# Altium schematic sheet Schematic_Sheet_1.SchDoc
size A4; SheetNumber: 1; SheetTotal: 1
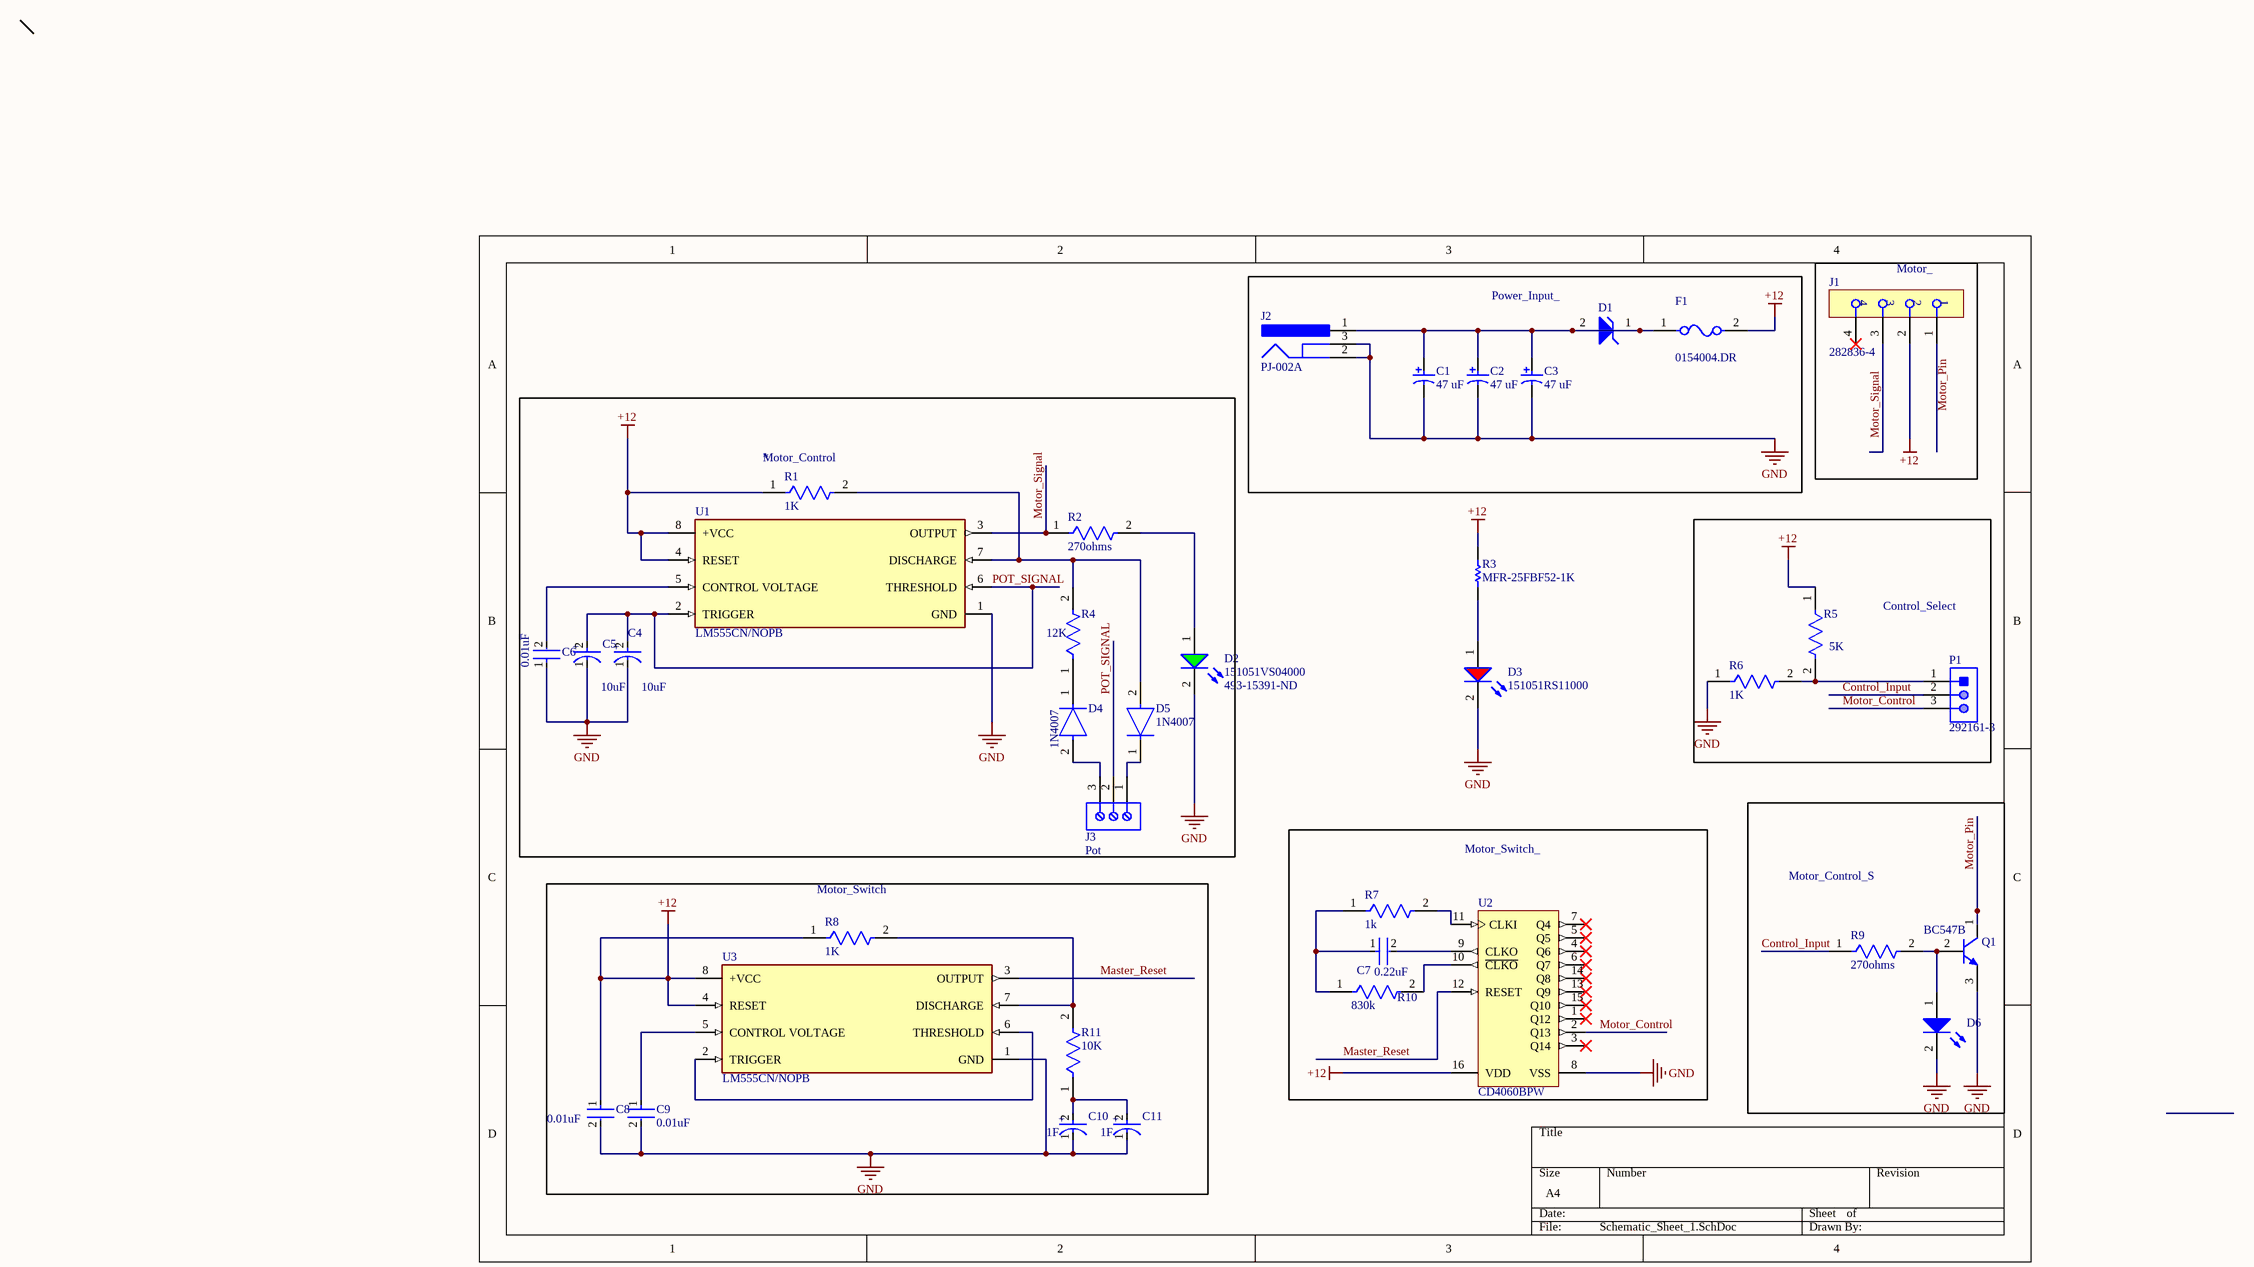
[diagram p0: Schematic_Sheet_1.SchDoc]

## Parts
C1  47 uF  [NIC-UVR-5x11-2_V]
C2  47 uF  [NIC-UVR-5x11-2_V]
C3  47 uF  [NIC-UVR-5x11-2_V]
C4  10uF  [FP-RAD-TH-D_12_5_0_5-L_20-MFG]
C5  10uF  [FP-RAD-TH-D_12_5_0_5-L_20-MFG]
C6  0.01uF  [FP-C410C104M5U5TA7200-MFG]
C7  0.22uF  [FP-C410C104M5U5TA7200-MFG]
C8  0.01uF  [FP-C410C104M5U5TA7200-MFG]
C9  0.01uF  [FP-C410C104M5U5TA7200-MFG]
C10  1F  [FP-RAD-TH-D_12_5_0_5-L_20-MFG]
C11  1F  [FP-RAD-TH-D_12_5_0_5-L_20-MFG]
D1  P6KE36ARLG  [ONSC-SURMETIC40-2-017AA-01]  (value not drawn)
D2  151051VS04000  Supplier Part Number 1: 493-15391-ND  [WL-TMRC_D5.9H8.7]
D3  151051RS11000  [WL-TMRC_D5.9H8.7]
D4  1N4007  [FP-1N4007-MFG]
D5  1N4007  [FP-1N4007-MFG]
D6  151051BS04000  [WL-TMRC_D5.9H8.7]  (value not drawn)
F1  0154004.DR  [FP-0154-MFG]
J1  282836-4  [FP-282836-4-MFG]
J2  PJ-002A  [CUI-PJ-002A_V]
J3  Pot  [691101710003]
P1  292161-3  [TECO-292161-3_V]
Q1  BC547B  [ONSC-TO-92-3-29-11]
R1  1K  [FP-MRS1600-MFG]
R2  270ohms  [FP-MRS1600-MFG]
R3  MFR-25FBF52-1K  [RESA60-630X240]
R4  12K  [FP-MRS1600-MFG]
R5  5K  [FP-MRS1600-MFG]
R6  1K  [FP-MRS1600-MFG]
R7  1k  [FP-MRS1600-MFG]
R8  1K  [FP-MRS1600-MFG]
R9  270ohms  [FP-MRS1600-MFG]
R10  830k  [FP-MRS1600-MFG]
R11  10K  [FP-MRS1600-MFG]
U1  LM555CN/NOPB  [FP-P0008A-MFG]
U2  CD4060BPW  [PW0016A_L]
U3  LM555CN/NOPB  [FP-P0008A-MFG]

## Blocks framed on the sheet
Power_Input_: C1-C3 D1 F1 J2
Motor_: J1
Motor_Control: C4-C6 D2 D4 D5 J3 R1 R2 R4 U1
Control_Select: P1 R5 R6
Motor_Switch_: C7 R7 R10 U2
Motor_Control_S: D6 Q1 R9
Motor_Switch: C8-C11 R8 R11 U3

## Nets
+12: C8.1 F1.2 J1.2 R1.1 R3.1 R5.1 R8.1 U1.4(RESET) U1.8(+VCC) U2.16(VDD) U3.4(RESET) U3.8(+VCC)
GND: C1.2 C2.2 C3.2 C4.1(C) C5.1(C) C6.1 C8.2 C9.2 C10.1(C) C11.1(C) D2.2(K) D3.2(K) D6.2(K) J2.2 J2.3 Q1.3(E) R6.1 U1.1(GND) U2.8(VSS) U3.1(GND)
Control_Input: P1.2 R9.1
Master_Reset: U2.12(RESET) U3.3(OUTPUT)
Motor_Control: P1.3 U2.2(Q13)
Motor_Pin: Q1.1(C)
Motor_Signal: J1.3 R2.1 U1.3(OUTPUT)
POT_SIGNAL: C4.2(A) C5.2(A) J3.2 U1.2(TRIGGER) U1.6(THRESHOLD)
NetC1_1: C1.1 C2.1 C3.1 D1.1(K) D1.2(A) F1.1 J2.1
NetC6_2: C6.2 U1.5(CONTROL_VOLTAGE)
NetC7_1: C7.1 R7.1 R10.1
NetC7_2: C7.2 U2.9(CLKO)
NetC9_1: C9.1 U3.5(CONTROL_VOLTAGE)
NetC10_2: C10.2(A) C11.2(A) R11.1
NetD2_1: D2.1(A) R2.2
NetD3_1: D3.1(A) R3.2
NetD4_1: D4.1(C) R4.1
NetD4_2: D4.2(A) J3.3
NetD5_1: D5.1(C) J3.1
NetD5_2: D5.2(A) R1.2 R4.2 U1.7(DISCHARGE)
NetD6_1: D6.1(A) Q1.2(B) R9.2
NetP1_1: P1.1 R5.2 R6.2
NetR7_2: R7.2 U2.11(CLKI)
NetR8_2: R8.2 R11.2 U3.7(DISCHARGE)
NetR10_2: R10.2 U2.10(~{CLKO})
NetU3_2: U3.2(TRIGGER) U3.6(THRESHOLD)

Not connected (* = marked no-connect by the designer): J1 1 4*; U2 1(Q12)* 3(Q14)* 4(Q6)* 5(Q5)* 6(Q7)* 7(Q4)* 13(Q9)* 14(Q8)* 15(Q10)*

## Notes on the sheet
- Labels drawn without touching a wire or pin: Motor_Pin
- (in symbol CMP-05427-000677-1) +

## Library data of the parts
C1-C3 = CMP-1217-00002-1: Aluminum Electrolytic Capacitor, 47 uF +/-20%, 35 V, -40 to 85 degC, 2-Pin THD, RoHS, Bulk; Manufacturer: Nichicon; PartNumber: UVR1V470MDD; Rated Voltage: 35 V; Rated Ripple: 130 mA; Mounting Technology: Through Hole; Temperature Range: -40 to 85 degC; Rated Capacitance: 47 uF; ComponentLink3Description: Package Specification; ComponentLink1URL: http://www.nichicon.co.jp/; Packing: Bulk; DatasheetVersion: Sep-13; RoHS: TRUE; PackageDescription: 2-Pin Through Hole Device, Dia 5 mm, Body Length 11 mm, Pin Spacing 2 mm; ComponentLink3URL: http://nichicon-us.com/english/products/pdfs/e-vr.pdf; ComponentLink1Description: Manufacturer URL; Capacitance Tolerance: +/-20%; ComponentLink2Description: Datasheet; ComponentLink2URL: http://nichicon-us.com/english/products/pdfs/e-vr.pdf
C4 C5 = CMP-05427-000677-1: Aluminum Electrolytic Capacitors (Radial Lead Type) 20uF ±20% 450V; Ripple Current: 130mA; Lead Diameter: 0.6mm; Life (Hours): 2000Hour; Lead/Base Style: Straight; Package Quantity: 500; Radiation Hardening: No; Series: M; Voltage Rating (DC): 450V; Voltage Rating: 450V; Lead Pitch: 5mm; Height - Seated (Max): 0.866inch; Max Operating Temperature: 85°C; Termination: Radial; Case/Package: Radial; Capacitance: 10uF; Min Operating Temperature: -25°C; Tolerance: 20%; Length: 20mm; Mount: Through Hole; Height: 20mm; Packaging: Ammo Pack; Diameter: 12.5mm; RoHS Compliant: Yes
C6-C9 = CMP-03020-034640-1: CAP CER 0.1UF 50V Z5U AXIAL; Capacitance: 100nF; Tolerance: 20%; Lead Diameter: 0.51mm; Dissipation Factor: 4%; Lead Length: 25.4mm; Mount: Through Hole; Length: 4.32mm; Lead Free: Lead Free; Number of Pins: 2; Case/Package: Axial; Max Operating Temperature: 85°C; RoHS Compliant: Yes; Dielectric: Z5U; Min Operating Temperature: 10°C; Series: Aximax 400; Termination: Axial; Radiation Hardening: No; Voltage Rating (DC): 50V; REACH SVHC: No SVHC; Construction: AXIAL; Package Quantity: 5000; Packaging: Tape and Reel; Voltage Rating: 50V
C10 C11 = CMP-05427-000677-1: Aluminum Electrolytic Capacitors (Radial Lead Type) 10uF ±20% 450V; Ripple Current: 130mA; Lead Diameter: 0.6mm; Life (Hours): 2000Hour; Lead/Base Style: Straight; Package Quantity: 500; Radiation Hardening: No; Series: M; Voltage Rating (DC): 450V; Voltage Rating: 450V; Lead Pitch: 5mm; Height - Seated (Max): 0.866inch; Max Operating Temperature: 85°C; Termination: Radial; Case/Package: Radial; Capacitance: 10uF; Min Operating Temperature: -25°C; Tolerance: 20%; Length: 20mm; Mount: Through Hole; Height: 20mm; Packaging: Ammo Pack; Diameter: 12.5mm; RoHS Compliant: Yes
D1 = CMP-1061-00690-1: 600 W Peak Power Transient Voltage Suppressor, 2-Pin Surmetic(TM) 40, Pb-Free, Tape and Reel; Manufacturer: On Semiconductor; V(BR) Typ (V): 36; PPK Max (W): 600; IR Max (uA): 5; Direction: Unidirectional; Packing: Tape and Reel; PackageReference: SURMETIC40-2-017AA-01; ComponentLink1Description: Manufacturer URL; ComponentLink3Description: Package Specification; RoHS: Pb-Free; ComponentLink2Description: Datasheet; PackageDescription: 2-Pin, Axial Lead, Diameter 3.49 mm; ComponentLink2URL: http://www.onsemi.com/pub_link/Collateral/P6KE6.8A-D.PDF; Mounting Technology: Through Hole; ComponentLink1URL: http://www.onsemi.com/; PartNumber: P6KE36ARLG; ComponentLink3URL: http://www.onsemi.cn/pub_link/Collateral/017AA.PDF; PackageVersion: Rev. O, 09/2005; DatasheetVersion: Rev. 10
D2 = CMP-1488-00007-2: NexarPartId: 29717814; Manufacturer: Nichicon; Manufacturer Part Number: UKL1HR15KDDANA; Forward Voltage: 2.1V; Viewing Angle: 40°; Lens Size: 5mm; Luminous Intensity: 140mcd; Color: Green; Max Reverse Voltage (DC): 5V; Wavelength: 572nm; Forward Current: 100mA; Peak Wavelength: 573nm; Test Current: 20mA; Lens Style: Circular, Diffused, Round; Value: 150nF; Tolerance: 10%; Voltage Rating: 50V; Ripple Current: 1.6mA; Life (Hours): 2000Hour; REACH SVHC: Unknown; Height: 8.6mm; Mount: Through Hole; Width: 5mm; Length: 5mm; Min Operating Temperature: -40°C; RoHS: Compliant; Dominant Wavelength: 572nm; Case/Package: Radial; Max Operating Temperature: 85°C; Packaging: Bulk; Supplier 1: Digikey; Category: Aluminum Electrolytic Capacitors; Stock 1: 3618; Pricing 1: 1=0.29, 10=0.188, 50=0.1386, 100=0.1129, 500=0.08914, 2000=0.07131, 4000=0.06975 (USD); Mounting Technology: Through Hole; Package Quantity: 200; Series: UKL; Termination: Radial; Diameter: 5mm; Lead Pitch: 0.079inch; Height - Seated (Max): 0.472inch; Radiation Hardening: No; RoHS Compliant: Yes; ComponentLink1URL: https://datasheet.ciiva.com/11688/e-kl-11688681.pdf?src-supplier=Avnet; ComponentLink1Description: https://datasheet.ciiva.com/11688/e-kl-11688681.pdf?src-supplier=Avnet; ComponentLink2URL: https://datasheet.ciiva.com/109/e-kl-109678.pdf?src-supplier=Digikey; ComponentLink2Description: https://datasheet.ciiva.com/109/e-kl-109678.pdf?src-supplier=Digikey
D3 = CMP-1488-00008-2: NexarPartId: 29717813; Lens Style: Circular, Diffused, Round; Lens Size: 5mm; Forward Voltage: 2.1V; Peak Wavelength: 650nm; Forward Current: 100mA; Viewing Angle: 60°; Color: Red; Wavelength: 630nm; Test Current: 20mA; Dominant Wavelength: 645nm; Luminous Intensity: 30mcd; Max Reverse Voltage (DC): 5V; Height: 8.6mm; Length: 5mm; Min Operating Temperature: -40°C; Max Operating Temperature: 85°C; Packaging: Bulk; REACH SVHC: Unknown; Case/Package: Radial; RoHS: Compliant; Width: 5mm; Mount: Through Hole
D4 D5 = CMP-123542-000001-1: Rectifier diode 1000 V 1 A DO-41, ,; Manufacturer: Diotec; Max Surge Forward Current: 27A; Forward Current: 1A; Max Junction Temp: +175°C; Reverse Voltage: 1000V; Value: 15pF; Peak Reverse Current: 5uA; Category: Diode; Temperature Range Low: -50°C; Automotive: No; Temperature: -50°C to +175°C; Lead Free: Yes; ComponentLink2Description: Datasheet; Max Repetitive Reverse Voltage: 1000V; ComponentLink2URL: https://datasheet.octopart.com/1N4007-Diotec-datasheet-62346875.pdf; Manufacturer Part Number: 1N4007; Device Class L3: Rectifier Diodes; Height: 2.8mm; Octopart: https://octopart.com/1n4007-diotec-4040411; Package: 1N4007; Temperature Range High: +175°C; Device Class L1: Discrete Semiconductors; Device Class L2: Diodes; RoHS: TRUE; Capacitance: 15pF; Ipc Land Pattern Name: DIOAD888W100L520D280
D6 = CMP-1488-00009-2: NexarPartId: 29717812; Test Current: 20mA; Forward Voltage: 3.2V; Wavelength: 470nm; Lens Size: 5mm; Lens Style: Circular, Diffused, Round; Forward Current: 100mA; Peak Wavelength: 465nm; Viewing Angle: 40°; Luminous Intensity: 500mcd; Max Reverse Voltage (DC): 5V; Color: Blue; Case/Package: Radial; Width: 5mm; Mount: Through Hole; Min Operating Temperature: -40°C; Length: 5mm; Height: 8.6mm; Max Operating Temperature: 85°C; Packaging: Bulk; RoHS: Compliant; REACH SVHC: Unknown; Dominant Wavelength: 470nm
F1 = CMP-08605-000003-1: FUSE BRD MNT 4A 125VAC/VDC 2SMD; Manufacturer: Littelfuse; Fuse Blow Speed: Fast; Max Fuse Ac Voltage: 125V; Lead Free: Yes; Device Class L3: unset; Manufacturer Part Number: 0154004.DR; Device Class L2: Fuses; Package: 0154; ComponentLink2Description: Datasheet; Temperature Range Low: -55°C; Temperature Range High: +125°C; Device Class L1: Circuit Protection; Height: 3.81mm; Temperature: -55°C to +125°C; Mouser Description: Surface Mount Fuses Fuseblock w/ fuse 4A OMNI BLOK 154; Automotive: No; Digikey Description: FUSE BRD MNT 4A 125VAC/VDC 2SMD; RoHS: TRUE; Category: Fuse; Fuse Current: 4A; Max Fuse Dc Voltage: 125V; ComponentLink2URL: https://www.littelfuse.com/~/media/electronics/datasheets/fuses/littelfuse_fuse_154_154t_154l_154tl_datasheet.pdf.pdf; Octopart: https://octopart.com/0154004.dr-littelfuse-565861
J1 = CMP-03790-46505329-1: 282836-4 Connector, Terminal Block; Wire Receptacle; 4 Pos.; 16-30 AWG; 0.197 in. CL; Sid; Manufacturer Lifecycle Status: ACTIVE; Number of Contacts: 4; Max Supply Voltage (AC): 300V; Wire Gauge (Min): 30AWG; Max Current Rating: 13.5A; Approvals: UL; Number of Levels: 1; Thread Size: M3; Connector System: Wire-to-Board; Voltage Rating (DC): 250V; Pitch: 5mm; Plating: Brass; Tail Length: 3.5mm; Housing Color: Green; Number of Rows: 1; REACH SVHC: Unknown; Lead Pitch: 5mm; Depth: 8.2mm; Lead Free: Lead Free; Mount: Through Hole; Contact Plating: Tin; Housing Material: Polyamide; ELV: Compliant; Radiation Hardening: No; RoHS: Compliant; Number of Circuits: 4; Voltage Rating: 300V; Contact Material: Brass; NexarPartId: 46505329; Current Rating: 13.5A; Max Voltage Rating (AC): 300V; Orientation: Straight; Number of Positions: 4; Lifecycle Status: Production; Operating Supply Voltage: 300V; Connector Type: Receptacle; Number of Positions Per Level: 4; Flammability Rating: UL94 V-0; Packaging: Bulk; Termination: Screw, Solder; Wire Gauge (Max): 30AWG; Number of Poles: 4; Width: 10mm; Voltage Rating (AC): 250V; Length: 20mm; Current: 13.5A; Voltage: 300V; Color: Green
J2 = CMP-2000-06895-2: Through Hole Right Angle DC Power Jack, 2.5 A, 2 mm Center Pin, 3 Position, -25 to 85 degC, RoHS, Bulk; Manufacturer: CUIInc.; Brand: CUI; Inside Contact Diameter: 2mm; Voltage Rating: 24V; Outside Contact Diameter: 6.5mm; Current Rating: 2.5A; Insulation Resistance: 50MOhms; Contact Gender: Male; Connector Type: DCPowerJack; Datasheet Version: Rev. 1.03, 04/2016; Housing Material: PolybutyleneTerephthalate(PBT); Operating Temperature Range: -25Cto+85C; Termination Style: ThroughHole; Product Category: DCPowerConnectors; Mounting Technology: ThroughHole; Mounting Style: ThroughHole; Factory Pack Quantity: 500; Contact Plating: Nickel; Package Reference: PJ-002A; Mounting Angle: Right; Package Description: 3-Pin Through Hole Device, Body 14.4 x 9 mm, Height 11 mm; Flammability Rating: UL94V-0; Manufacturer URL: http://www.cui.com/; Product: Jacks; Contact Material: Copper; Datasheet URL: http://www.cui.com/product/resource/pj-002a.pdf; RoHS: True
J3 = CMP-1502-03257-2: NexarPartId: 8917705; Voltage Rating: 250V; Current: 16A; Wire Gauge (Min): 14AWG; Pitch: 5.0038mm; Wire Gauge (Max): 26AWG; Number of Positions Per Level: 3; Plating: Steel; Number of Levels: 1; Stripping Length: -7mm; REACH SVHC: Unknown; Width: 16.2mm; Height: 16.4mm; Contact Material: Brass; RoHS: Compliant; Color: Blue; Contact Plating: Tin; Lead Pitch: 5mm; Packaging: Box; Termination: Screw; Number of Contacts: 3; Wire/Cable Gauge: 26AWG; Min Operating Temperature: -40°C; Max Operating Temperature: 105°C; Housing Material: Nylon; Length: 9mm; Voltage: 250V; Mount: Through Hole; Current Rating: 16A; Number of Pins: 3
P1 = CMP-2000-05551-1: Male Header, Pitch 2 mm, 1 x 3 Position, Height 6.8 mm, Tail Length 3.2 mm, -40 to 105 degC, RoHS, Bulk; Manufacturer: TE Connectivity; SVHC: NoSVHC(15-Jun-2015); Pitch Spacing: 2mm; Contact Termination Type: ThroughHole; No. of Rows: 1Rows; No. of Contacts: 3Contacts; Product Range: AMPCTSeries; Mounting Technology: ThroughHole; Manufacturer URL: http://www.te.com/; Contact Material: Brass; Datasheet URL: http://www.te.com/commerce/DocumentDelivery/DDEController?Action=showdoc&DocId=Customer+Drawing%7F292161%7FP1%7Fpdf%7FEnglish%7FENG_CD_292161_P1.pdf%7F292161-3; Package Reference: 292161-3; Contact Plating: TinPlatedContacts; Gender: Header; Datasheet Version: Rev. P1, 06/2016; Package Description: Male Header, Pitch 2 mm, 1 x 3 Position, Height 6.8 mm, Tail Length 3.2 mm
Q1 = CMP-1048-01467-1: Amplifier Transistor, NPN Silicon, 3-Pin TO-92, Bulk Box; Manufacturer: On Semiconductor; IC Continuous (A): 0.1; fT Min (MHz): 150; DatasheetVersion: Rev. 7; ComponentLink1URL: http://www.onsemi.com/; Polarity: NPN; RoHS: FALSE; ComponentLink1Description: Manufacturer URL; Packing: Bulk Box; PackageDescription: 3-Pin Transistor Outline, Body 4.825 x 3.685 mm, Pitch 1.27 mm; ComponentLink3URL: http://www.onsemi.cn/pub_link/Collateral/2N6426-D.PDF; ComponentLink2Description: Datasheet; PackageVersion: Rev. AM; PackageReference: TO-92-3-29-11_AM_SL; ComponentLink3Description: Package Specification; Mounting Technology: Through Hole; PartNumber: BC547B; ComponentLink2URL: http://www.onsemi.com/pub_link/Collateral/BC546-D.PDF
R1 R2 R4-R11 = CMP-02408-000019-1: RES 20K OHM 0.4W 1% AXIAL; Max Power Dissipation: 400mW; Temperature Coefficient: 50ppm/°C; Resistance: 20kR; Technology: THIN FILM; Max Operating Temperature: 155°C; Number of Terminations: 2; RoHS Compliant: Yes; Packaging: Tape and Reel; Radiation Hardening: No; Contact Plating: Tin; Military Standard: Not; Construction: Cylindrical; Diameter: 1.6mm; Tolerance: 1%; Mount: Through Hole; Power Rating: 400mW; Case/Package: Conformal; Termination: Axial; Length: 3.6mm; Min Operating Temperature: -55°C; Resistor Type: Metal Film; Series: MRS16
R3 = CMP-1659-00075-1: Axial Resistor, 1 KOhm, +/- 1%, 0.25W, -55 to 155 degC, 2-Pin THD, RoHS, Bulk; Voltage Rating: 250 V; Resistance: 10 kohm; Power Rating: 250 mW; ComponentLink2Description: Datasheet; RoHSCompliant: true; PackageReference: MFR-25; Case\Package: Axial; Max Operating Temperature: 155 degC; DatasheetVersion: Apr-13; Tolerance: 1%; ComponentLink1URL: http://www.yageo.com/; Length: 0.248 inch; ComponentLink2URL: http://www.yageo.com/documents/recent/Yageo%20LR_MFR_2013.pdf; Packaging: Bulk; Package Quantity: 200; PackageDescription: 2-Pin Axial Lead, Dia 2.4 mm, Body Length 6.3 mm; Min Operating Temperature: -55 degC; ComponentLink1Description: Manufacturer URL
U1 U3 = CMP-0056-00016-4: IC OSC SINGLE TIMER 100KHZ 8-DIP; Manufacturer: Texas Instruments; Min Supply Voltage: 4.5V; Standoff Height: 0.51mm; Number Of Timers/Counters: 1; Max Supply Voltage: 16V; Max Junction Temp: +70°C; Nominal Supply Current: 3mA; ComponentLink2Description: Datasheet; Category: IC; Manufacturer Part Number: LM555CN/NOPB; Digikey Description: IC OSC SINGLE TIMER 100KHZ 8-DIP; Ambient Temperature Range High: +70°C; Automotive: No; Device Class L3: Timers and Oscillators; Device Class L1: Integrated Circuits (ICs); Temperature Range High: +70°C; Lead Free: Yes; ComponentLink2URL: http://www.ti.com/lit/ds/symlink/lm555.pdf; Octopart: https://octopart.com/lm555cn%2Fnopb-texas+instruments-24814897; RoHS: TRUE; Ambient Temperature Range Low: 0°C; Temperature Range Low: 0°C; Package: P0008A; Temperature: 0°C to +70°C; Height: 5.08mm; Device Class L2: Clock and Timing
U2 = CMP-1086-00016-4: CMOS 14-Stage Ripple Carry Binary Counter / Divider and Oscillator, 3 to 18 V, -55 to 125 degC, 16-Pin TSSOP (PW), Green (RoHS & no Sb/Br), Tube; Manufacturer: Texas Instruments; tPHL, tPLH (typ) @ 5 V: 370 ns; VDD: 3 to 18 V; PackageDescription: 16-Pin Plastic Small-Outline Package, Body 5 x 4.4 mm, Pitch 0.65 mm; PartNumber: CD4060BPW; ComponentLink1Description: Manufacturer URL; ComponentLink1URL: http://www.ti.com; ComponentLink3Description: Package Specification; PackageReference: PW0016A; ComponentLink2URL: http://www.ti.com/lit/ds/symlink/cd4060b.pdf; DatasheetVersion: SCHS049C; ComponentLink2Description: Datasheet; Packing: Tube; Mounting Technology: Surface Mount; ComponentLink3URL: http://www.ti.com/lit/ml/mpds361/mpds361.pdf; PackageVersion: 4040064-4/G; Note1: Green (RoHS & no Sb/Br); Temperature Range: -55 to 125 degC